# Altium schematic sheet EEPROM.SchDoc
size A3
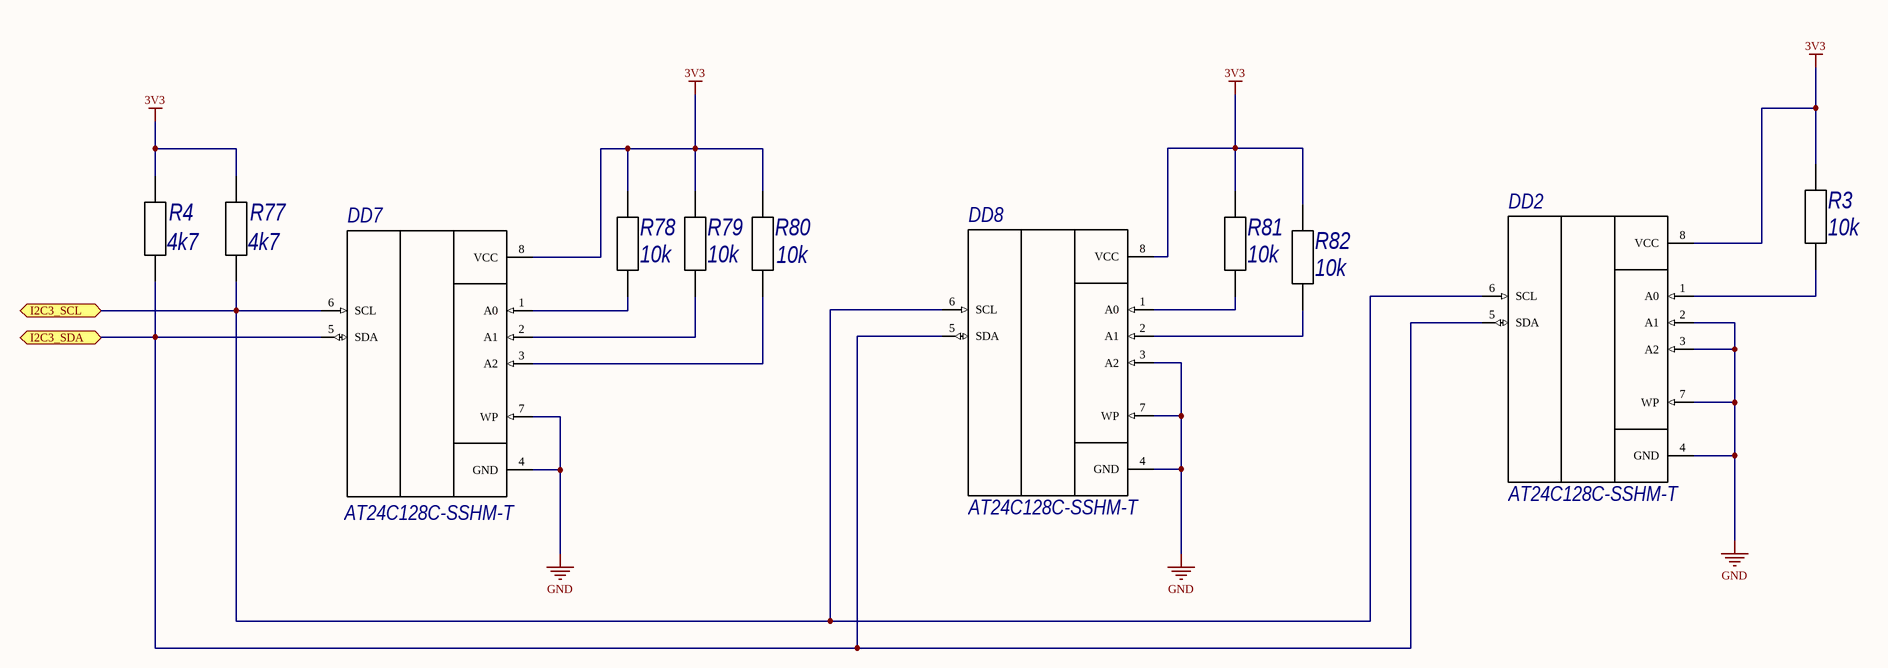
[diagram p0: EEPROM.SchDoc]

## Parts
DD2  AT24C128C-SSHM-T  [SOIC127P600X175-8N]
DD7  AT24C128C-SSHM-T  [SOIC127P600X175-8N]
DD8  AT24C128C-SSHM-T  [SOIC127P600X175-8N]
R3  10k  [C0805R]
R4  4k7  [C0805R]
R77  4k7  [C0805R]
R78  10k  [C0805R]
R79  10k  [C0805R]
R80  10k  [C0805R]
R81  10k  [C0805R]
R82  10k  [C0805R]

## Ports
I2C3_SCL (bidir), I2C3_SDA (bidir)

## Nets
3V3: DD2.8(VCC) DD7.8(VCC) DD8.8(VCC) R3.2 R4.2 R77.2 R78.2 R79.2 R80.2 R81.2 R82.2
GND: DD2.2(A1) DD2.3(A2) DD2.4(GND) DD2.7(WP) DD7.4(GND) DD7.7(WP) DD8.3(A2) DD8.4(GND) DD8.7(WP)
I2C3_SCL: DD2.6(SCL) DD7.6(SCL) DD8.6(SCL) R77.1 ; port I2C3_SCL
I2C3_SDA: DD2.5(SDA) DD7.5(SDA) DD8.5(SDA) R4.1 ; port I2C3_SDA
NetDD2_1: DD2.1(A0) R3.1
NetDD7_1: DD7.1(A0) R78.1
NetDD7_2: DD7.2(A1) R79.1
NetDD7_3: DD7.3(A2) R80.1
NetDD8_1: DD8.1(A0) R81.1
NetDD8_2: DD8.2(A1) R82.1

## Library data of the parts
DD2 DD7 DD8 = AT24C128C-SSHM-T: EEPROM Memory IC 128Kb _16K x 8_ IÂ²C 1MHz 550ns 8-SOIC; MF: Microchip; MP: AT24C128C-SSHM-T; SnapEDA_Link: https://www.snapeda.com/parts/AT24C128C-SSHM-T/Microchip/view-part/1771999/?ref=snap; Value: *; Package: SO-8 Microchip; Price: None; Availability: Unavailable
R3 R4 R77-R82 = RES_0805: Published: 24.03.2010; Publisher: Andrew Danich; Type: Резистор